# EAGLE schematic exercise_3_Q4 (EAGLE 9.6.2)
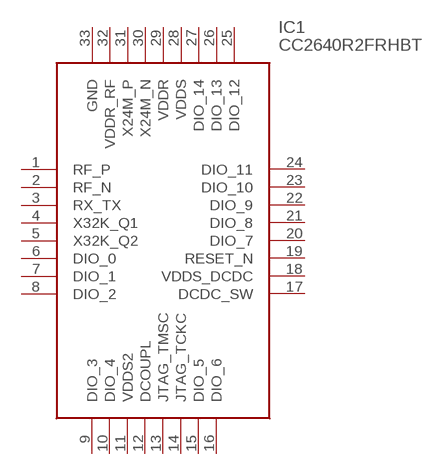
[diagram p0: schematic, sheet 1]

## Parts
IC1  CC2640R2FRHBT  [QFN50P500X500X100-33N]
Unconnected: IC1.1(RF_P) IC1.2(RF_N) IC1.3(RX_TX) IC1.4(X32K_Q1) IC1.5(X32K_Q2) IC1.6(DIO_0) IC1.7(DIO_1) IC1.8(DIO_2) IC1.9(DIO_3) IC1.10(DIO_4) IC1.11(VDDS2) IC1.12(DCOUPL) IC1.13(JTAG_TMSC) IC1.14(JTAG_TCKC) IC1.15(DIO_5) IC1.16(DIO_6) IC1.17(DCDC_SW) IC1.18(VDDS_DCDC) IC1.19(RESET_N) IC1.20(DIO_7) IC1.21(DIO_8) IC1.22(DIO_9) IC1.23(DIO_10) IC1.24(DIO_11) IC1.25(DIO_12) IC1.26(DIO_13) IC1.27(DIO_14) IC1.28(VDDS) IC1.29(VDDR) IC1.30(X24M_N) IC1.31(X24M_P) IC1.32(VDDR_RF) IC1.33(GND)

## Library data of the parts
IC1 = CC2640R2FRHBT:CC2640R2FRHBT: SimpleLink Bluetooth low energy wireless MCU Source: Datasheet <http://www.ti.com/lit/gpn/CC2640R2F>; ARROW_PART_NUMBER: CC2640R2FRHBT; ARROW_PRICE-STOCK: https://www.arrow.com/en/products/cc2640r2frhbt/texas-instruments?region=nac; DESCRIPTION: SimpleLink Bluetooth low energy wireless MCU; HEIGHT: 1mm; MANUFACTURER_NAME: Texas Instruments; MANUFACTURER_PART_NUMBER: CC2640R2FRHBT; MOUSER_PART_NUMBER: 595-CC2640R2FRHBT; MOUSER_PRICE-STOCK: https://www.mouser.co.uk/ProductDetail/Texas-Instruments/CC2640R2FRHBT?qs=6ZHl3BmPMW1THU0nD14Wvg%3D%3D